# Altium schematic sheet QCopterCAM_CAM_Sch.SchDoc
size A4
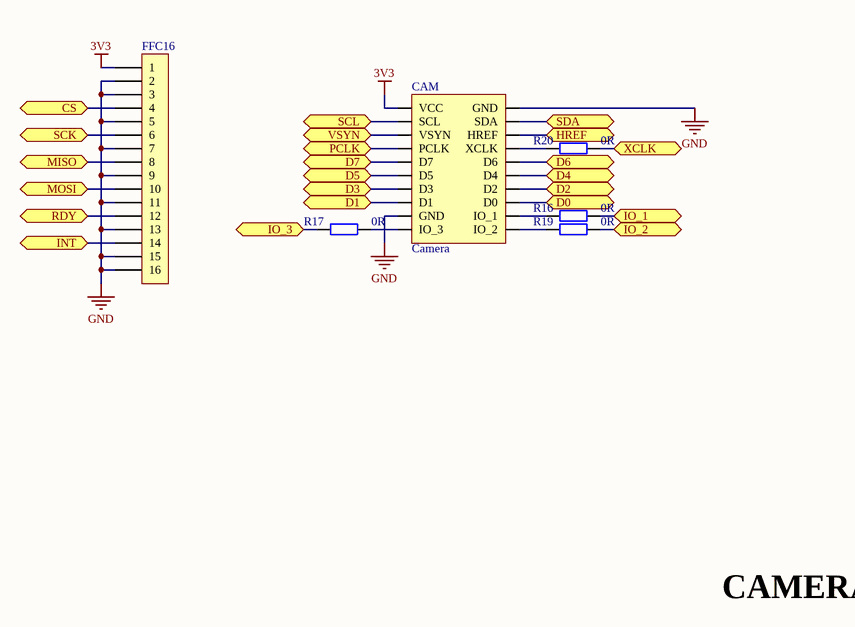
[diagram p0: QCopterCAM_CAM_Sch.SchDoc]

## Parts
CAM  Camera  [CAMERA]
FFC16  FFC_0.5_16  [FFC_0.5_16]  (value not drawn)
R16  value 0R  [RES_0603]  (hidden comment: Res_0603)
R17  value 0R  [RES_0603]  (hidden comment: Res_0603)
R19  value 0R  [RES_0603]  (hidden comment: Res_0603)
R20  value 0R  [RES_0603]  (hidden comment: Res_0603)

## Ports
CS, D0, D1, D2, D3, D4, D5, D6, D7, HREF, INT, IO_1, IO_2, IO_3, MISO, MOSI, PCLK, RDY, SCK, SCL, SDA, VSYN, XCLK

## Nets
3V3: CAM.1(VCC) FFC16.1
GND: CAM.2(GND) CAM.17(GND) FFC16.2 FFC16.3 FFC16.5 FFC16.7 FFC16.9 FFC16.11 FFC16.13 FFC16.15 FFC16.16
CS: FFC16.4 ; port CS
D0: CAM.16(D0) ; port D0
D1: CAM.15(D1) ; port D1
D2: CAM.14(D2) ; port D2
D3: CAM.13(D3) ; port D3
D4: CAM.12(D4) ; port D4
D5: CAM.11(D5) ; port D5
D6: CAM.10(D6) ; port D6
D7: CAM.9(D7) ; port D7
HREF: CAM.6(HREF) ; port HREF
INT: FFC16.14 ; port INT
IO_1: R16.2 ; port IO_1
IO_2: R19.2 ; port IO_2
IO_3: R17.1 ; port IO_3
MISO: FFC16.8 ; port MISO
MOSI: FFC16.10 ; port MOSI
PCLK: CAM.7(PCLK) ; port PCLK
RDY: FFC16.12 ; port RDY
SCK: FFC16.6 ; port SCK
SCL: CAM.3(SCL) ; port SCL
SDA: CAM.4(SDA) ; port SDA
VSYN: CAM.5(VSYN) ; port VSYN
XCLK: R20.2 ; port XCLK
NetCAM_8: CAM.8(XCLK) R20.1
NetCAM_18: CAM.18(IO_1) R16.1
NetCAM_19: CAM.19(IO_3) R17.2
NetCAM_20: CAM.20(IO_2) R19.1

## Notes on the sheet
- CAMERA

## Library data of the parts
CAM = Camera: Module
FFC16 = FFC_0.5_16: FFC
R16 R17 R19 R20 = Res_0603: Resistor